# Altium schematic sheet signal.SchDoc
size A4
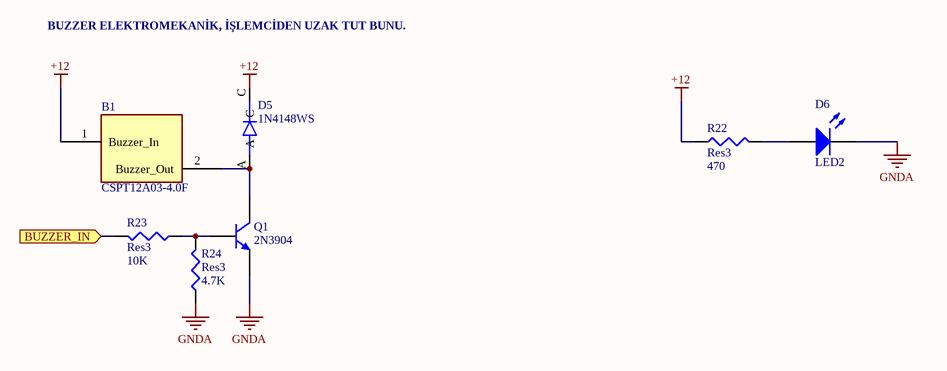
[diagram p0: signal.SchDoc]

## Parts
B1  CSPT12A03-4.0F  [Buzzer SMD]
D5  1N4148WS  [1N4148WS]
D6  LED2  [3.2X1.6X1.1]
Q1  2N3904  [TO-92A]
R22  Res3  value 470  [12Z-2010]
R23  Res3  value 10K  [J1-0603]
R24  Res3  value 4.7K  [J1-0603]

## Ports
BUZZER_IN (in)

## Nets
+12: B1.1(Buzzer_In) D5.C R22.1
GNDA: D6.2(K) Q1.1(E) R24.1
BUZZER_IN: R23.2 ; port BUZZER_IN
NetB1_2: B1.2(Buzzer_Out) D5.A Q1.3(C)
NetD6_1: D6.1(A) R22.2
NetQ1_2: Q1.2(B) R23.1 R24.2

## Notes on the sheet
- BUZZER ELEKTROMEKANİK, İŞLEMCİDEN UZAK TUT BUNU.

## Library data of the parts
B1 = Buzzer SMD 5MM: 12V 1mA 5MM 85dB 7.5X7.5X2 SMD Buzzer without circuit
D5 = 1N4148WS: Diode Standard 75V 150mA Surface Mount SOD-323F; MF: ON Semiconductor; Price: None; SnapEDA_Link: https://www.snapeda.com/parts/1N4148WS/ON%20Semiconductor/view-part/2747266/?ref=snap; Check_prices: https://www.snapeda.com/parts/1N4148WS/ON%20Semiconductor/view-part/2747266/?ref=eda; MP: 1N4148WS; Availability: Good; Value: *; Purchase-URL: https://pricing.snapeda.com/search/part/1N4148WS/?ref=eda; Package: SOD-323FL-2 ON Semiconductor
D6 = LED2: Typical RED, GREEN, YELLOW, AMBER GaAs LED; Published: 8-Jun-2000; LatestRevisionDate: 17-Jul-2002; LatestRevisionNote: Re-released for DXP Platform.; PackageVersion: Feb-2002; PackageReference: 3.2X1.6X1.1; Publisher: Altium Limited; PackageDescription: SM LED; 2 Flat Leads
Q1 = 2N3904: NPN General Purpose Amplifier; Published: 8-Jun-2000; LatestRevisionDate: 15-Jan-2003; LatestRevisionNote: PCB Footprint 'BCY-W3/D4.7' replaced; DatasheetVersion: 1997; PackageVersion: Sep-1998; PackageReference: TO-92A; Publisher: Altium Limited; PackageDescription: TO, Flat Index; 3 In-Line, Axial Leads; Body Dia. 4.5mm; Leads 0.51 x 0.48 mm (max); ComponentLink1Description: Manufacturer Link; ComponentLink1URL: http://www.fairchildsemi.com/; ComponentLink2Description: Datasheet; ComponentLink2URL: http://www.fairchildsemi.com/ds/2N%2F2N3904.pdf
R22-R24 = Res3: Resistor; Published: 8-Jun-2000; LatestRevisionDate: 29-May-2009; LatestRevisionNote: IPC-7351 Footprint Added.; PackageReference: J1-0603; Publisher: Altium Limited; PackageDescription: Chip Resistor